# EAGLE schematic debouncer (EAGLE 6.2)
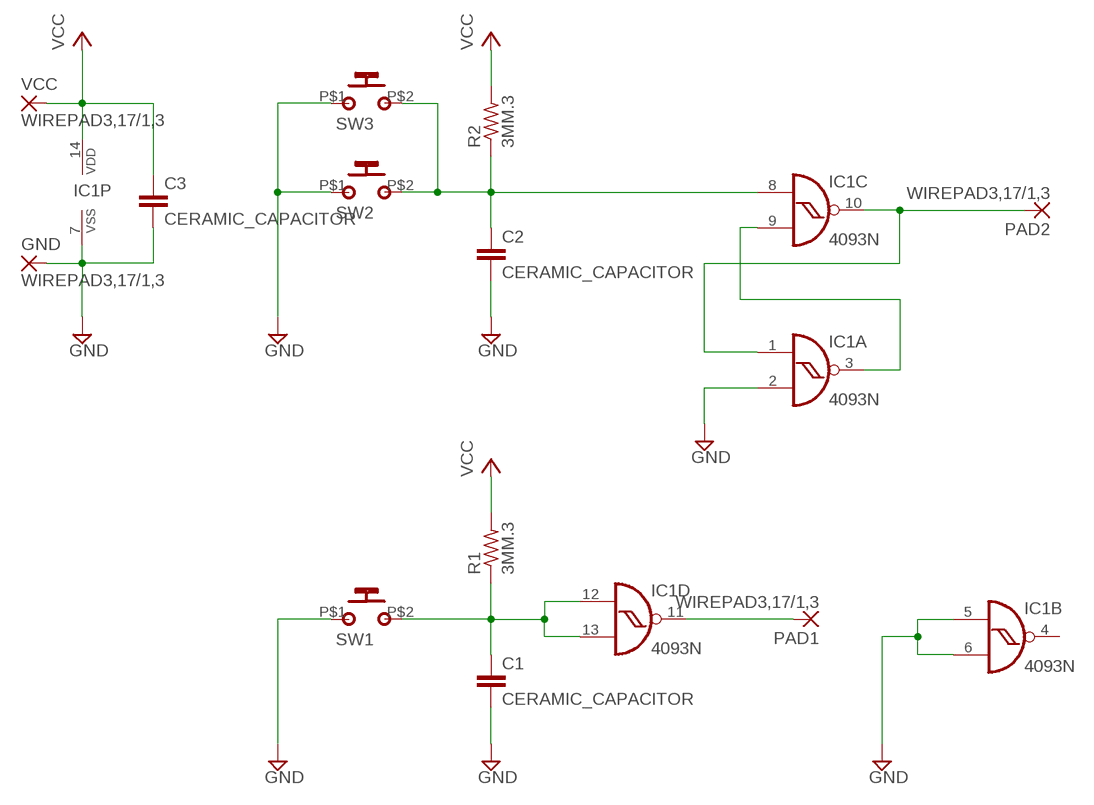
[diagram p0: schematic, sheet 1]

## Parts
C1  CERAMIC_CAPACITOR  [CERAMIC_CAP]
C2  CERAMIC_CAPACITOR  [CERAMIC_CAP]
C3  CERAMIC_CAPACITOR  [CERAMIC_CAP]
GND  WIREPAD3,17/1,3  [3,17/1,3]
IC1  4093N  [DIL14]
PAD1  WIREPAD3,17/1,3  [3,17/1,3]
PAD2  WIREPAD3,17/1,3  [3,17/1,3]
R1  3MM.3  [R0204/3]
R2  3MM.3  [R0204/3]
SW1  MOMENTARY_SW_SMALL  [MOMENTARY_SW_SMALL]
SW2  MOMENTARY_SW_SMALL  [MOMENTARY_SW_SMALL]
SW3  MOMENTARY_SW_SMALL  [MOMENTARY_SW_SMALL]
VCC  WIREPAD3,17/1,3  [3,17/1,3]

## Nets
GND: C1.2 C2.2 C3.2 GND.1(P) IC1.2(A:I1) IC1.5(B:I0) IC1.6(B:I1) IC1.7(P:VSS) SW1.P$1(P) SW2.P$1(P) SW3.P$1(P)
N$1: C2.1 IC1.8(C:I0) R2.1 SW2.P$2(S) SW3.P$2(S)
N$2: IC1.3(A:O) IC1.9(C:I1)
N$3: C1.1 IC1.12(D:I0) IC1.13(D:I1) R1.1 SW1.P$2(S)
N$4: IC1.11(D:O) PAD1.1(P)
N$5: IC1.1(A:I0) IC1.10(C:O) PAD2.1(P)
VCC: C3.1 IC1.14(P:VDD) R1.2 R2.2 VCC.1(P)
Unconnected: IC1.4(B:O)

## Library data of the parts
C1-C3 = 00_steve:CERAMIC_CAPACITOR
GND PAD1 PAD2 VCC = wirepad:WIREPAD: Wire PAD connect wire on PCB
IC1 = 40xx:4093: Quad 2-input NAND schmitt trigger
R1 R2 = gm-resistors:3MM: 3mm Resistors Leads spaced 1-6 holes apart for 0.1" perfboard. Suitable for 1/8 watt resistors.
SW1-SW3 = 00_steve:MOMENTARY_SW_SMALL